# Altium schematic sheet ECEN404_Team54_V2.SchDoc
size A; SheetNumber: 1; SheetTotal: 2
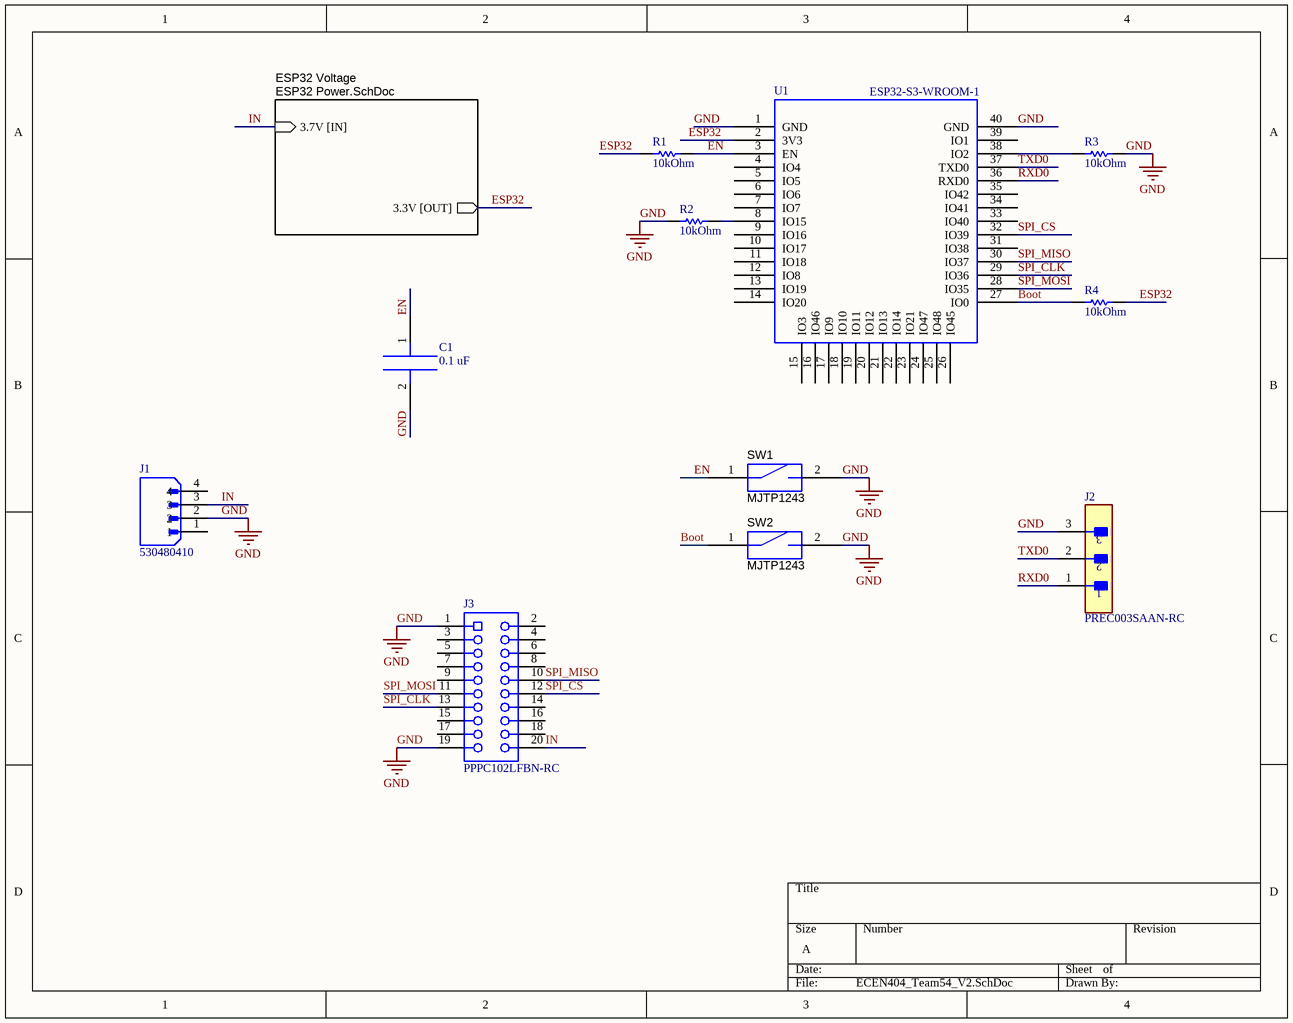
[diagram p0: ECEN404_Team54_V2.SchDoc]

## Parts
C1  value 0.1 uF  [1206 Capacitor]  (hidden comment: GMC31X7R104K6R3NT)
J1  530480410  [MOLEX_530480410]
J2  PREC003SAAN-RC  [FP-PREC003SAAN-RC-MFG]
J3  PPPC102LFBN-RC  [SLIN-PPPC102LFBN-RC_V]
R1  10kOhm  [RESC3216X70X50LL05T20]
R2  10kOhm  [RESC3216X70X50LL05T20]
R3  10kOhm  [RESC3216X70X50LL05T20]
R4  10kOhm  [RESC3216X70X50LL05T20]
SW1  MJTP1243  [MJTP1243]
SW2  MJTP1243  [MJTP1243]
U1  ESP32-S3-WROOM-1  [ESP32-WROOM1]

## Sub-sheets
ESP32 Voltage = ESP32 Power.SchDoc: 3.7V [IN] (in), 3.3V [OUT] (out)

## Nets
GND: C1.2 J1.2 J2.3 J3.1 J3.19 R2.1 R3.2 SW1.2 SW2.2 U1.1(GND) U1.40(GND)
Boot: R4.1 SW2.1(GND) U1.27(IO0)
EN: C1.1 R1.2 SW1.1(GND) U1.3(EN)
ESP32: R1.1 R4.2 U1.2(3V3) ; sheet ESP32 Voltage/3.3V [OUT]
IN: J1.3 J3.20 ; sheet ESP32 Voltage/3.7V [IN]
RXD0: J2.1 U1.36(RXD0)
SPI_CLK: J3.13 U1.29(IO36)
SPI_CS: J3.12 U1.32(IO39)
SPI_MISO: J3.10 U1.30(IO37)
SPI_MOSI: J3.11 U1.28(IO35)
TXD0: J2.2 U1.37(TXD0)
NetR2_2: R2.2 U1.8(IO15)
NetR3_1: R3.1 U1.38(IO2)

Not connected (* = marked no-connect by the designer): J1 1 4; J3 2 3 4 5 6 7 8 9 14 15 16 17 18; U1 4(IO4) 5(IO5) 6(IO6) 7(IO7) 9(IO16) 10(IO17) 11(IO18) 12(IO8) 13(IO19) 14(IO20) 15(IO3) 16(IO46) 17(IO9) 18(IO10) 19(IO11) 20(IO12) 21(IO13) 22(IO14) 23(IO21) 24(IO47) 25(IO48) 26(IO45) 31(IO38) 33(IO40) 34(IO41) 35(IO42) 39(IO1)

## Library data of the parts
C1 = GMC31X7R104K6R3NT: 0.1 µF ±10% 6.3V Ceramic Capacitor X7R 1206 (3216 Metric)
J2 = CMP-00595-22265080-1: PREC003SAAN-RC Conn Header Vert 3POS 2.54MM; Number of Contacts: 3; Connector Type: Male Pin; Current Rating: 3A; Height: 8.74mm; Contact Mating Length: 5.842mm; Min Operating Temperature: -40°C; Termination: Solder; Packaging: Bulk; Pitch: 2.54mm; Color: Black; Mount: Through Hole; Contact Material: Nickel, Tin; Number of Rows: 1; NexarPartId: 22265080; Max Operating Temperature: 105°C; RoHS: Compliant; Contact Plating: Tin; Number of Positions: 3
J3 = CMP-1770-00003-1: Female Header, Pitch 2.54 mm, 2 x 10 Position, Height 8.75 mm, Tail Length 3.2 mm, -40 to 105 degC, RoHS, Bulk; Max Supply Voltage: 16 V; Frequency: 100 KHz; Case\Package: SOIC; Min Supply Voltage: 4.5 V; Max Ouput Current: -200 mA; Package Quantity: 2500; ComponentLink1Description: Datasheet; Min Operating Temperature: 0 degC; Pins: 8; Weight: 0.002561 oz; Radiation Hardening: No; Mount: Surface Mount; Width: 3.91 mm; RoHSCompliant: true; ComponentLink1URL: http://datasheet.octopart.com/PPPC102LFBN-RC-Sullins-datasheet-8327184.pdf; DatasheetVersion: Rev. D, 10/2007; Max Operating Temperature: 70 degC; Height: 1.58 mm; Length: 4.9 mm; PackageReference: PPPC102LFBN-RC; Packaging: Tape and Reel; REACH SVHC: No SVHC; PackageDescription: Female Header, Pitch 2.54 mm, 2 x 10 Position, Height 8.75 mm, Tail Length 3.2 mm
R1-R4 = CMP-2003-00018-1: ERJ-8ENF1002V; Manufacturer: Panasonic; Part Number: ERJ-8ENF1002V
SW1 SW2 = MJTP1243: Tactile Switch SPST-NO Top Actuated Through Hole
U1 = ESP32-WROOM1: RF TXRX MOD BT WIFI PCB TH SMD
J1 = 530480410: Availability: Unavailable; Price: None; Package: None; Value: *; MP: 530480410